# Altium schematic sheet ic.SchDoc
size A; SheetNumber: 1; SheetTotal: 3
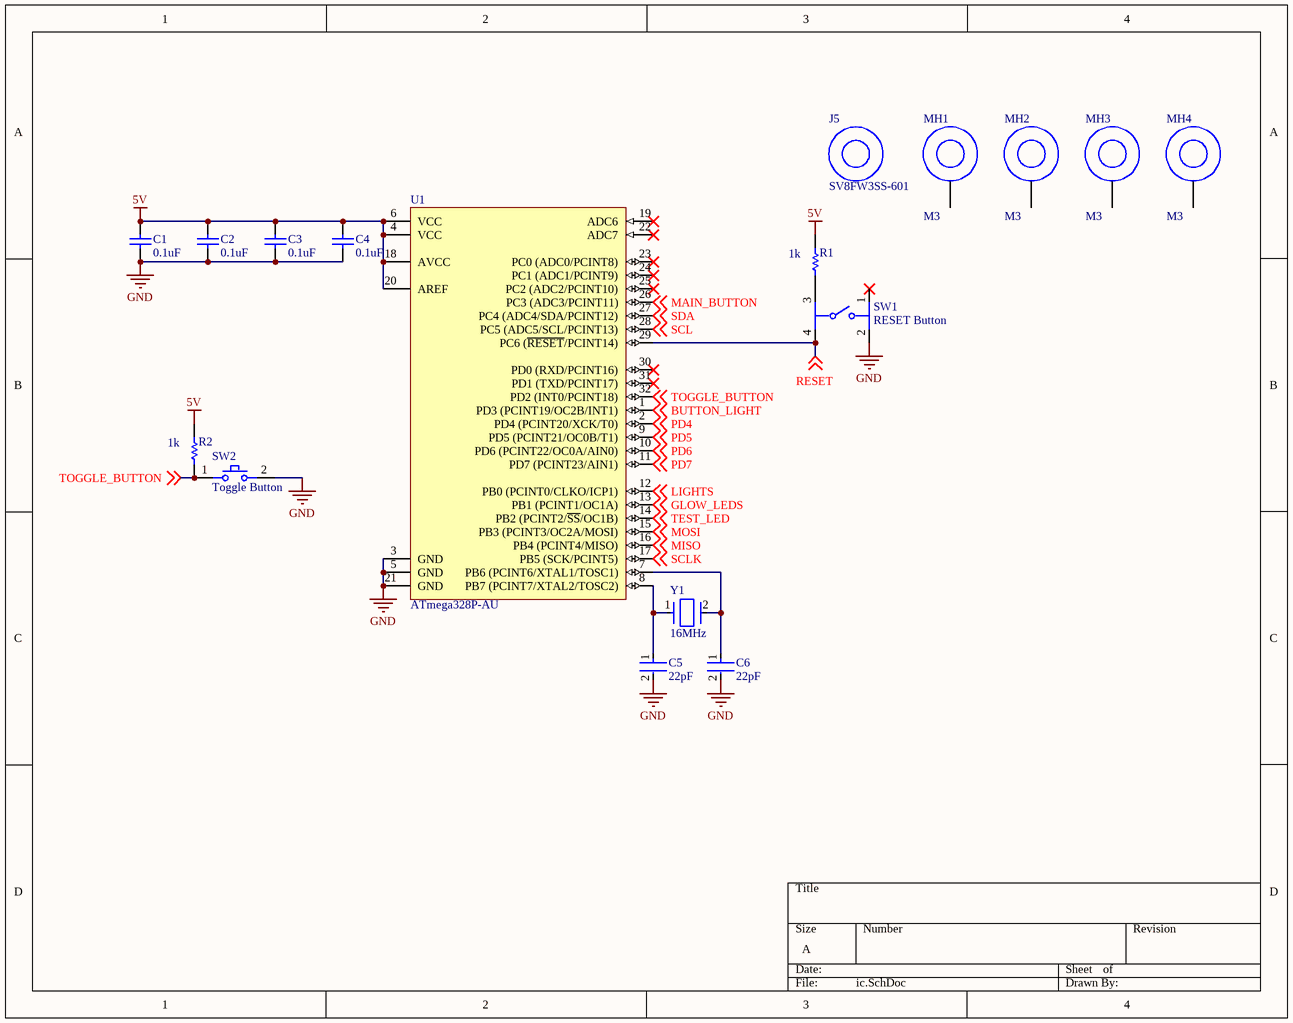
[diagram p0: ic.SchDoc]

## Parts
C1  0.1uF  [CAPC2013X135X45ML10T25]
C2  0.1uF  [CAPC2013X135X45ML10T25]
C3  0.1uF  [CAPC2013X135X45ML10T25]
C4  0.1uF  [CAPC2013X135X45ML10T25]
C5  22pF  [FP-C0805C-DN-MFG]
C6  22pF  [FP-C0805C-DN-MFG]
J5  SV8FW3SS-601  [SV8FW3SS-601]
MH1  M3  [PTH_M3]  (no BOM)
MH2  M3  [PTH_M3]  (no BOM)
MH3  M3  [PTH_M3]  (no BOM)
MH4  M3  [PTH_M3]  (no BOM)
R1  1k  [RESC2013X50X30NL20T20]
R2  1k  [RESC2013X50X30NL20T20]
SW1  RESET Button  [FP-PTS645SM43SMTR92LFS-MFG]
SW2  Toggle Button  [FP-B3AL-1003P-MFG]
U1  ATmega328P-AU  [32A_M]
Y1  16MHz  [FP-XRCHA-MFG]

## Nets
5V: C1.2 C2.2 C3.2 C4.2 R1.2 R2.2 U1.4(VCC) U1.6(VCC) U1.18(AVCC) U1.20(AREF)
GND: C1.1 C2.1 C3.1 C4.1 C5.2 C6.2 SW1.2 SW2.2 U1.3(GND) U1.5(GND) U1.21(GND)
BUTTON_LIGHT: U1.1(PD3_(PCINT19/OC2B/INT1)) ; off-sheet BUTTON_LIGHT
GLOW_LEDS: U1.13(PB1_(PCINT1/OC1A)) ; off-sheet GLOW_LEDS
LIGHTS: U1.12(PB0_(PCINT0/CLKO/ICP1)) ; off-sheet LIGHTS
MAIN_BUTTON: U1.26(PC3_(ADC3/PCINT11)) ; off-sheet MAIN_BUTTON
MISO: U1.16(PB4_(PCINT4/MISO)) ; off-sheet MISO
MOSI: U1.15(PB3_(PCINT3/OC2A/MOSI)) ; off-sheet MOSI
PD4: U1.2(PD4_(PCINT20/XCK/T0)) ; off-sheet PD4
PD5: U1.9(PD5_(PCINT21/OC0B/T1)) ; off-sheet PD5
PD6: U1.10(PD6_(PCINT22/OC0A/AIN0)) ; off-sheet PD6
PD7: U1.11(PD7_(PCINT23/AIN1)) ; off-sheet PD7
RESET: SW1.4 U1.29(PC6_(~{RESET}/PCINT14)) ; off-sheet RESET
SCL: U1.28(PC5_(ADC5/SCL/PCINT13)) ; off-sheet SCL
SCLK: U1.17(PB5_(SCK/PCINT5)) ; off-sheet SCLK
SDA: U1.27(PC4_(ADC4/SDA/PCINT12)) ; off-sheet SDA
TEST_LED: U1.14(PB2_(PCINT2/~{SS}/OC1B)) ; off-sheet TEST_LED
TOGGLE_BUTTON: R2.1 SW2.1 U1.32(PD2_(INT0/PCINT18)) ; off-sheet TOGGLE_BUTTON
NetC5_1: C5.1 U1.8(PB7_(PCINT7/XTAL2/TOSC2)) Y1.1
NetC6_1: C6.1 U1.7(PB6_(PCINT6/XTAL1/TOSC1)) Y1.2
NetR1_1: R1.1 SW1.3

Not connected (* = marked no-connect by the designer): MH1 1; MH2 1; MH3 1; MH4 1; SW1 1*; U1 19(ADC6)* 22(ADC7)* 23(PC0_(ADC0/PCINT8))* 24(PC1_(ADC1/PCINT9))* 25(PC2_(ADC2/PCINT10))* 30(PD0_(RXD/PCINT16))* 31(PD1_(TXD/PCINT17))*

## Library data of the parts
C1-C4 = CMP-2100-03644-1: Chip Capacitor, 0.1 uF, +/- 10%, 50 V, -55 to 125 degC, 0805 (2012 Metric), RoHS, Tape and Reel; Manufacturer: Murata; MPN: GRM21BR71H104KA01L; Voltage: 50V; Capacitance: 100nF; Insulation Resistance: 10GR; Dielectric Material: Ceramic; Dielectric: X7R; Package Description: 2-Pin Surface Mount Device, Body 2 x 1.25 mm; Manufacturer URL: http://www.murata.com/; Case Code (Imperial): 0805; Datasheet URL: http://psearch.en.murata.com/capacitor/product/GRM21BR71H104KA01%23.pdf; Termination: SMD/SMT; Lead Free: LeadFree; Package Quantity: 1; Mount: SurfaceMount; REACH SVHC: Unknown; Thickness: 0.053inch; Height: 1.25mm; Case/Package: 0805; Voltage Rating: 50V; Width: 0.049inch; Case Code (Metric): 2012; Material: Ceramic; Min Operating Temperature: -55degC; RoHSCompliant: true; Datasheet Version: 42675.0; Voltage Rating (DC): 50V; Tolerance: 10%; Package Reference: 0805; Depth: 1.25mm; Length: 2mm; Max Operating Temperature: 125degC; Packaging: TapeandReel; Number of Pins: 2; Radiation Hardening: No
C5 C6 = CMP-2007-00448-2: CAP CER 22PF 100V 5% NP0 0805; Manufacturer Part Number: C0805C220J1GACTU; Manufacturer: KEMET; Material: Ceramic; Temperature Coefficient: 30ppm/°C; Tolerance: 0.05; Temperature Characteristic: C0G; Value: 22 pF; RoHS: TRUE; ComponentLink2URL: https://content.kemet.com/datasheets/KEM_C1003_C0G_SMD.pdf; Capacitance: 22 pF; Mouser Description: Multilayer Ceramic Capacitor, C Series, 22 Pf, - 5%, C0g / Np0, 100 V, 0805 [2012 Metric] Rohs Compliant: Yes; Digikey Description: CAP CER 22PF 100V 5% NP0 0805; Octopart: https://octopart.com/c0805c220j1gactu-kemet-3791395; Device Class L3: Ceramic Capacitors; Device Class L2: Capacitors; Voltage Rating: 100 V; Temperature Range Low: -55°C; Ipc Land Pattern Name: CAPC200125X78; Lead Free: Yes; ComponentLink2Description: Datasheet; Category: Cap; Temperature: -55°C to +125°C; Package: C0805C-DN; Device Class L1: Passive Components; Temperature Range High: +125°C; Height: 0.88mm; Automotive: No; MPN: C0805C220J1GACTU
MH1-MH4 = PTH: M3 Plated Through Hole; Value: M3
R1 R2 = CMP-1013-00510-2: Part Number: CRCW08051K00FKEA; Manufacturer: Vishay Dale; MPN: CRCW08051K00FKEA
SW1 = CMP-2000-05160-2: SWITCH TACTILE SPST-NO 0.05A 12V; MPN: PTS645SM43SMTR92LFS; Contact Resistance: 100mR; Throw Configuration: SPST; Illumination Type: Non-Illuminated; Mechanical Life: 100000Cycles; Current Rating: 50mA; Switch Function: Off-Mom; Actuator Length: 0.85mm; Actuator Material: Nylon; Actuator Type: Standard; Operating Force: 160gf; Min Operating Temperature: -20°C; REACH SVHC: No SVHC; Termination: Gull Wing; Case/Package: SMD/SMT; Packaging: Tape and Reel; Mount: Surface Mount; Voltage Rating (DC): 12V; Orientation: Straight; Lead Free: Lead Free; Contact Material: Silver; Color: Black; Max Current Rating: 50mA; Contact Plating: Silver; Depth: 9mm; Package Quantity: 1; Max Voltage Rating (DC): 12V; Length: 6mm; Max Operating Temperature: 60°C
SW2 = CMP-08834-000018-1: SWITCH TACTILE SPST-NO 0.05A 16V; MPN: B3AL-1003P; Contact Resistance: 100mR; Illumination Type: Non-Illuminated; Electrical Life: 1000000Cycles; Switch Function: Off-Mom; Switch Travel: 1.3mm; Contact Current Rating: 50mA; Actuator Color: White; Operating Force: 3.5N; Throw Configuration: SPST; Package Quantity: 1; Orientation: Straight; Radiation Hardening: No; Packaging: Tape and Reel; Max Voltage Rating (DC): 16V; Mechanical Life: 1000000Cycles; Min Operating Temperature: -40°C; Depth: 6.6mm; Voltage Rating (DC): 16V; Contact Plating: Silver; Mount: Surface Mount; Series: B3AL; Termination: SMD/SMT; Max Current Rating: 50mA; RoHS Compliant: Yes; Max Operating Temperature: 90°C; Current Rating: 50mA; Length: 6.9mm; Weight: 0.18g
U1 = CMP-0095-00269-2: 8-bit AVR Microcontroller, 32KB Flash, 1KB EEPROM, 2KB SRAM, 32-pin TQFP, Industrial Grade (-40°C to 85°C); PackageDescription: 32-Lead, 7x7x1.0 mm Body, 0.8mm Lead Pitch, Thin Profile Plastic Quad Flat Package (TQFP); DatasheetVersion: revD, May-2011; RevisionNote: DatasheetVersion & PackageVersion updated. URLs added.; ComponentLink1URL: http://www.atmel.com/; ComponentLink2Description: ATmega48A/48PA/88A/88PA/168A/168PA/328/328P Datasheet; Code_JEDEC: MS-026-ABA; ComponentLink1Description: Manufacturer URL; PackageReference: 32A; ComponentLink3Description: ATmega48A/48PA/88A/88PA/168A/168PA/328/328P Summary; ComponentLink2URL: http://www.atmel.com/dyn/resources/prod_documents/doc8271.pdf; PackageVersion: revC, Oct-2010; ComponentLink3URL: http://www.atmel.com/dyn/resources/prod_documents/8271S.pdf
Y1 = CMP-06054-000011-1: CRYSTAL 16.0000MHZ 8PF SMD; MPN: XRCHA16M000F0A01R0; Frequency Stability: 100ppm; ESR (Equivalent Series Resistance): 100R; Frequency: 16MHz; Lead Pitch: 1.45mm; Packaging: Tape and Reel; Ratings: AEC-Q200; Weight: 0.000459oz; Width: 0.079inch; Load Capacitance: 8pF; Termination: SMD/SMT; Length: 0.098inch; Package Quantity: 3000; Frequency Tolerance: 100ppm; Max Operating Temperature: 125°C; Case/Package: SMD/SMT; Min Operating Temperature: -40°C; Height: 0.031inch; Mount: Surface Mount; Tolerance: 100ppm
J5 = SV8FW3SS-601: MPN: SV8FW3SS-601